# Altium schematic sheet CPU.SchDoc: Soldeerstation
size A4; DrawnBy: Sem Kirkels; DocumentNumber: 21P001S04; Revision: V1; SheetNumber: 4; SheetTotal: 5
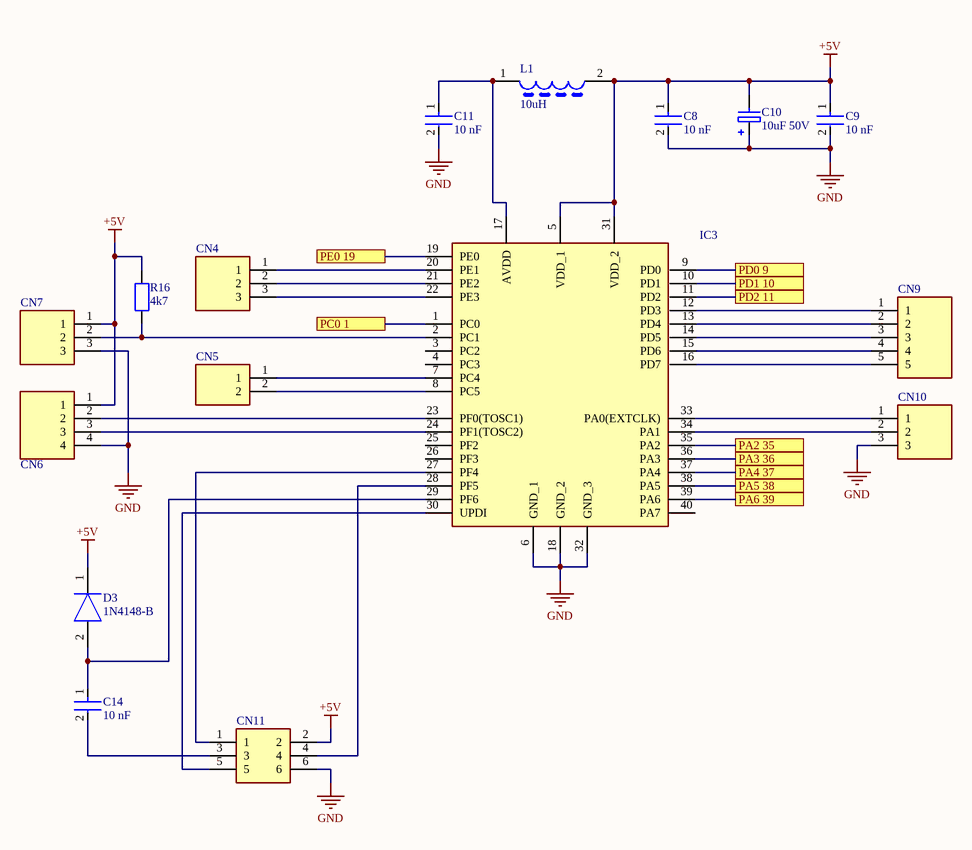
[diagram p0: CPU.SchDoc]

## Parts
C8  10 nF  [0805]
C9  10 nF  [0805]
C10  10uF 50V  [Elco 100uF 25V]
C11  10 nF  [0805]
C14  10 nF  [0805]
CN4  5-146280-3  [HDRV3W97P0X254_1X3_721X234X821P]  (value not drawn)
CN5  5-146280-2  [HDRV2W77P0X254_1X2_467X234X872P]  (value not drawn)
CN6  5-146280-4  [HDRV4W77P254_4X1_467X488X821P]  (value not drawn)
CN7  5-146280-3  [HDRV3W97P0X254_1X3_721X234X821P]  (value not drawn)
CN9  5-146280-5  [HDRV5W67P0X254_1X5_1229X234X821P]  (value not drawn)
CN10  5-146280-3  [HDRV3W97P0X254_1X3_721X234X821P]  (value not drawn)
CN11  2x3 Pin Header  [HDRV6W67P254_2X3_721X488X872P]  (value not drawn)
D3  1N4148-B  [DIOAD1220W56L420D200]
IC3  ATMEGA4809-PF  [DIP1543W58P254L5175H635Q40N]  (value not drawn)
L1  10uH  [VLS6045]
R16  4k7  [0805]

## Ports
PA2 35, PA3 36, PA4 37, PA5 38, PA6 39, PC0 1, PD0 9, PD1 10, PD2 11, PE0 19

## Nets
+5V: C8.1 C9.1 C10.2 CN6.1 CN7.1 CN11.2 D3.1(K) IC3.5(VDD_1) IC3.31(VDD_2) L1.2 R16.1
GND: C8.2 C9.2 C10.1 C11.2 CN6.4 CN7.3 CN10.3 CN11.6 IC3.6(GND_1) IC3.18(GND_2) IC3.32(GND_3)
PA2 35: IC3.35(PA2) ; port PA2 35
PA3 36: IC3.36(PA3) ; port PA3 36
PA4 37: IC3.37(PA4) ; port PA4 37
PA5 38: IC3.38(PA5) ; port PA5 38
PA6 39: IC3.39(PA6) ; port PA6 39
PC0 1: IC3.1(PC0) ; port PC0 1
PD0 9: IC3.9(PD0) ; port PD0 9
PD1 10: IC3.10(PD1) ; port PD1 10
PD2 11: IC3.11(PD2) ; port PD2 11
PE0 19: IC3.19(PE0) ; port PE0 19
NetC11_1: C11.1 IC3.17(AVDD) L1.1
NetC14_1: C14.1 D3.2(A) IC3.29(PF6)
NetC14_2: C14.2 CN11.3
NetCN4_1: CN4.1 IC3.20(PE1)
NetCN4_2: CN4.2 IC3.21(PE2)
NetCN4_3: CN4.3 IC3.22(PE3)
NetCN5_1: CN5.1 IC3.7(PC4)
NetCN5_2: CN5.2 IC3.8(PC5)
NetCN6_2: CN6.2 IC3.23(PF0(TOSC1))
NetCN6_3: CN6.3 IC3.24(PF1(TOSC2))
NetCN7_2: CN7.2 IC3.2(PC1) R16.2
NetCN9_1: CN9.1 IC3.12(PD3)
NetCN9_2: CN9.2 IC3.13(PD4)
NetCN9_3: CN9.3 IC3.14(PD5)
NetCN9_4: CN9.4 IC3.15(PD6)
NetCN9_5: CN9.5 IC3.16(PD7)
NetCN10_1: CN10.1 IC3.33(PA0(EXTCLK))
NetCN10_2: CN10.2 IC3.34(PA1)
NetCN11_1: CN11.1 IC3.27(PF4)
NetCN11_4: CN11.4 IC3.28(PF5)
NetCN11_5: CN11.5 IC3.30(UPDI)

Not connected (* = marked no-connect by the designer): IC3 3(PC2) 4(PC3) 25(PF2) 26(PF3) 40(PA7)

## Library data of the parts
C8 C9 C11 C14 = Condensator 0805: Chip Multilayer Ceramic Capacitors for General Purpose, 0805, 10uF, X5R, 15%, 10%, 25V; Length: 2mm; Depth: 1.25mm; Termination: SMD/SMT; Voltage: 25V; Height: 1.25mm; Material: Ceramic; Thickness: 0.053inch; Radiation Hardening: No; Min Operating Temperature: -55°C; Width: 0.049inch; Package Quantity: 1; Mount: Surface Mount; Dielectric: X5R; Packaging: Tape and Reel; Capacitance: 10uF; Voltage Rating (DC): 25V; Lead Free: Lead Free; Max Operating Temperature: 85°C; Case Code (Imperial): 0805; Case/Package: 0805; Tolerance: 10%; Voltage Rating: 25V; Case Code (Metric): 2012
C10 = Condensator Elco: Part Number: 02015A270JAT2A; Manufacturer: AVX Interconnect / Elco
CN4 CN7 = 3 Pin Header L: Connector 5-146280-3; Manufacturer_Name: TE Connectivity; Datasheet Link: https://componentsearchengine.com//5-146280-3.pdf; Height: 8.21mm; Mouser2 Part Number: 571-5-146280-3; Mouser2 Price/Stock: https://www.mouser.com/Search/Refine.aspx?Keyword=571-5-146280-3; Manufacturer_Part_Number: 5-146280-3
CN5 = 2 Pin Header L: Connector; Manufacturer_Name: TE Connectivity; Datasheet Link: http://www.te.com/commerce/DocumentDelivery/DDEController?Action=showdoc&DocId=Customer+Drawing%7F146280%7FH2%7Fpdf%7FEnglish%7FENG_CD_146280_H2.pdf%7F5-146280-2; Height: 8.72mm; Manufacturer_Part_Number: 5-146280-2
CN6 = 4 Pin Header L: Connector 5-146280-4; Manufacturer_Name: TE Connectivity; Datasheet Link: https://datasheet.datasheetarchive.com/originals/distributors/DKDS-20/396066.pdf; Height: 8.21mm; Manufacturer_Part_Number: 5-146280-4
CN9 = 5 Pin Header: Connector 5-146280-5; Manufacturer_Name: TE Connectivity; Datasheet Link: https://componentsearchengine.com//5-146280-5.pdf; Height: 8.21mm; Mouser2 Part Number: 571-5-146280-5; Mouser2 Price/Stock: https://www.mouser.com/Search/Refine.aspx?Keyword=571-5-146280-5; Manufacturer_Part_Number: 5-146280-5
CN10 = 3 Pin Header: Connector 5-146280-3; Manufacturer_Name: TE Connectivity; Datasheet Link: https://componentsearchengine.com//5-146280-3.pdf; Height: 8.21mm; Mouser2 Part Number: 571-5-146280-3; Mouser2 Price/Stock: https://www.mouser.com/Search/Refine.aspx?Keyword=571-5-146280-3; Manufacturer_Part_Number: 5-146280-3
CN11 = 2x3 Pin Header: Connector; Manufacturer_Name: TE Connectivity; Manufacturer_Part_Number: 5-146256-3; Datasheet Link: https://www.te.com/commerce/DocumentDelivery/DDEController?Action=srchrtrv&DocNm=146256&DocType=Customer+Drawing&DocLang=English; Height: 8.72mm
D3 = 1N4148-B: Diode; Manufacturer_Name: Rectron; Manufacturer_Part_Number: 1N4148-B
IC3 = ATMEGA4809-PF: Integrated Circuit; Manufacturer_Name: Microchip; Datasheet Link: https://componentsearchengine.com//ATMEGA4809-PF.pdf; Height: 6.35mm; Mouser2 Part Number: 556-ATMEGA4809-PF; Mouser2 Price/Stock: https://www.mouser.com/Search/Refine.aspx?Keyword=556-ATMEGA4809-PF; Manufacturer_Part_Number: ATMEGA4809-PF
L1 = Smoorspoel: Inductor VLS6045EX-100M-H; Manufacturer_Name: TDK; Datasheet Link: https://componentsearchengine.com//VLS6045EX-100M-H.pdf; Mouser2 Part Number: 810-VLS6045EX-100M-H; Mouser2 Price/Stock: https://www.mouser.com/Search/Refine.aspx?Keyword=810-VLS6045EX-100M-H; Manufacturer_Part_Number: VLS6045EX-100M-H
R16 = Resistor 0805: Manufacturer: Vishay Dale; Part Number: CRCW08050000Z0EA